# EAGLE design PowerWaechter (EAGLE 9.6.2)
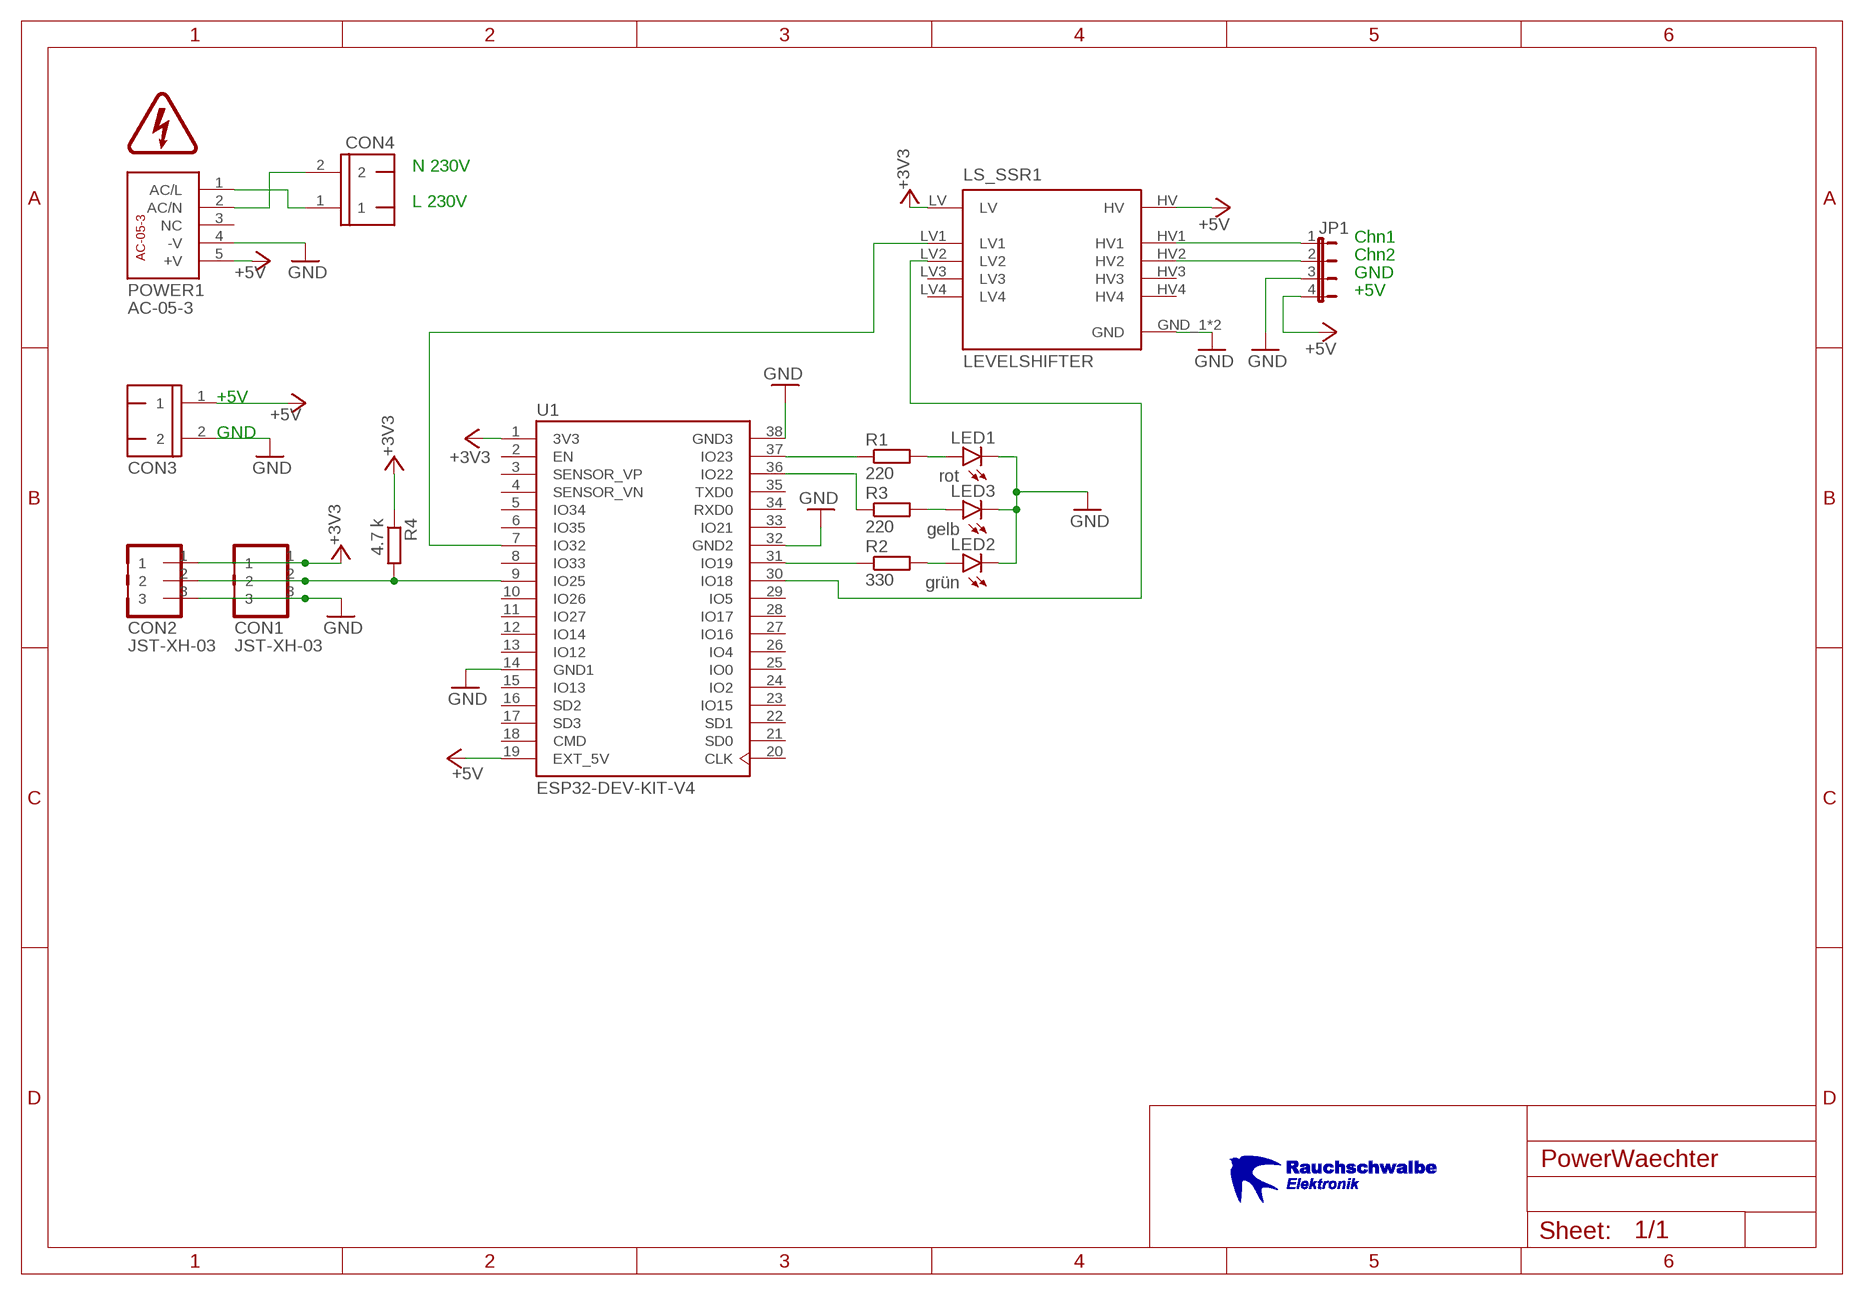
[diagram p0: schematic, sheet 1]

## Parts
CON1  JST-XH-03  [JST-XH-03]
CON2  JST-XH-03  [JST-XH-03]
CON3  WAGO-500-2  [WAGO-500-2]
CON4  WAGO-500-2  [WAGO-500-2]
JP1  JP4E  [JP4]
LED1  rot  LED3MM  [LED3MM]
LED2  grün  LED3MM  [LED3MM]
LED3  gelb  LED3MM  [LED3MM]
LS_SSR1  LEVELSHIFTER  [LEVELSHIFTER]
POWER1  AC-05-3  [AC-05-3]
R1  220  R_10MM0207/10  [0207/10]
R2  330  R_10MM0207/10  [0207/10]
R3  220  R_10MM0207/10  [0207/10]
R4  4.7 k  R_10MM0207/10  [0207/10]
U1  ESP32-DEV-KIT-V4  [ESP32-DEV-KIT-V4]
U$1  WARNLABLE_BLITZ_KLEIN  [WARNLABLE_BLITZ_KLEIN]
U$2  LOGO_RAUCHSCHWALBE_KLEIN  [LOGO_RAUCHSCHWALBE_KLEIN]

## Nets
+3V3 [Versorgung]: CON1.1 CON2.1 LS_SSR1.LV R4.1 U1.1(3V3)
+5V [Versorgung]: CON3.1 JP1.4 LS_SSR1.HV POWER1.5(+V) U1.19(EXT_5V)
GND [Versorgung]: CON1.3 CON2.3 CON3.2 JP1.3 LED1.K(C) LED2.K(C) LED3.K(C) LS_SSR1.GND_1(GND) LS_SSR1.GND_2(GND) POWER1.4(-V) U1.14(GND1) U1.32(GND2) U1.38(GND3)
N$1 [Data]: R1.1 U1.37(IO23)
N$5 [Data]: LED3.A R3.2
N$6 [Data]: R2.1 U1.31(IO19)
N$7 [Data]: LED1.A R1.2
N$8 [Data]: LED2.A R2.2
N$9 [Data]: R3.1 U1.36(IO22)
N$10 [Data]: LS_SSR1.LV1 U1.7(IO32)
N$11 [Data]: CON1.2 CON2.2 R4.2 U1.9(IO25)
N$16 [Data]: LS_SSR1.LV2 U1.30(IO18)
N$18 [Data]: JP1.1 LS_SSR1.HV1
N$19 [Data]: JP1.2 LS_SSR1.HV2
PHASE_L [Netzspannung]: CON4.1 POWER1.1(AC/L)
PHASE_N [Netzspannung]: CON4.2 POWER1.2(AC/N)
Unconnected: LS_SSR1.HV3 LS_SSR1.HV4 LS_SSR1.LV3 LS_SSR1.LV4 POWER1.3(NC) U1.2(EN) U1.3(SENSOR_VP) U1.4(SENSOR_VN) U1.5(IO34) U1.6(IO35) U1.8(IO33) U1.10(IO26) U1.11(IO27) U1.12(IO14) U1.13(IO12) U1.15(IO13) U1.16(SD2) U1.17(SD3) U1.18(CMD) U1.20(CLK) U1.21(SD0) U1.22(SD1) U1.23(IO15) U1.24(IO2) U1.25(IO0) U1.26(IO4) U1.27(IO16) U1.28(IO17) U1.29(IO5) U1.33(IO21) U1.34(RXD0) U1.35(TXD0)

## Notes on the sheet
- N 230V
- L 230V
- Chn1
- Chn2
- GND
- +5V
- +5V
- GND

## Library data of the parts
CON1 CON2 = PowerGuard:JST-XH-03
CON3 CON4 = PowerGuard:WAGO-500-2: WAGO SCREW CLAMP; MPN: 237-102; OC_FARNELL: unknown; OC_NEWARK: 70K9898
JP1 = jumper:JP4E: JUMPER
LED1-LED3 = PowerGuard:LED: LED OSRAM: - CHIPLED LG R971, LG N971, LY N971, LG Q971, LY Q971, LO R971, LY R971 LH N974, LH R974 LS Q976, LO Q976, LY Q976 LO Q996 - Hyper CHIPLED LW Q18S LB Q993, LB Q99A, LB R99A - SideLED LS A670, LO A670, LY A670, LG A670, LP A670 LB A673, LV A673, LT A673, LW A673 LH A674 LY A675 LS A676, LA A676, LO A676, LY A676, LW A676 LS A679, LY A679, LG A679 - Hyper Micro SIDELED® LS Y876, LA Y876, LO Y876, LY Y876 LT Y87S - SmartLED LW L88C, LW L88S LB L89C, LB L89S, LG L890 LS L89K, LO L89K, LY L89K LS L896, LA L896, LO L896, LY L896 - TOPLED LS T670, LO T670, LY T670, LG T670, LP T670 LSG T670, LSP T670, LSY T670, LOP T670, LYG T670 LG T671, LOG T671, LSG T671 LB T673, LV T673, LT T673, LW T673 LH T674 LS T676, LA T676, LO T676, LY T676, LB T676, LH T676, LSB T676, LW T676 LB T67C, LV T67C, LT T67C, LS T67K, LO T67K, LY T67K, LW E67C LS E67B, LA E67B, LO E67B, LY E67B, LB E67C, LV E67C, LT E67C LW T67C LS T679, LY T679, LG T679 LS T770, LO T770, LY T770, LG T770, LP T770 LB T773, LV T773, LT T773, LW T773 LH T774 LS E675, LA E675, LY E675, LS T675 LS T776, LA T776, LO T776, LY T776, LB T776 LHGB T686 LT T68C, LB T68C - Hyper Mini TOPLED® LB M676 - Mini TOPLED Santana® LG M470 LS M47K, LO M47K, LY M47K Source: http://www.osram.convergy.de LUXEON: - LUMILED® LXK2-PW12-R00, LXK2-PW12-S00, LXK2-PW14-U00, LXK2-PW14-V00 LXK2-PM12-R00, LXK2-PM12-S00, LXK2-PM14-U00 LXK2-PE12-Q00, LXK2-PE12-R00, LXK2-PE12-S00, LXK2-PE14-T00, LXK2-PE14-U00 LXK2-PB12-K00, LXK2-PB12-L00, LXK2-PB12-M00, LXK2-PB14-N00, LXK2-PB14-P00, LXK2-PB14-Q00 LXK2-PR12-L00, LXK2-PR12-M00, LXK2-PR14-Q00, LXK2-PR14-R00 LXK2-PD12-Q00, LXK2-PD12-R00, LXK2-PD12-S00 LXK2-PH12-R00, LXK2-PH12-S00 LXK2-PL12-P00, LXK2-PL12-Q00, LXK2-PL12-R00 Source: www.luxeon.com KINGBRIGHT: KA-3528ASYC Source: www.kingbright.com
LS_SSR1 = PowerGuard:LEVELSHIFTER: Logic Level Converter - Bi-Direc Check availability <https://pricing.snapeda.com/parts/BOB-12009/SparkFun/view-part?ref=eda>; AVAILABILITY: In Stock; DESCRIPTION: BSS138 Logic-Level Translator Interface Evaluation Board; MF: SparkFun; MP: BOB-12009; PACKAGE: None; PRICE: None; PURCHASE-URL: https://pricing.snapeda.com/search?q=BOB-12009&ref=eda
POWER1 = PowerGuard:AC-05-3: AC-05-3 AZ-Delivery AC-05-3 Mininetzteil 230V => 5V
R1-R4 = PowerGuard:R_10MM: RESISTOR, European symbol; SPICEPREFIX: R
U1 = PowerGuard:ESP32-DEV-KIT-V4: ESP32-DEVKITC Check availability <https://pricing.snapeda.com/parts/ESP32-DEVKITC/Espressif%20Systems/view-part?ref=eda>; AVAILABILITY: In Stock; CHECK_PRICES: https://www.snapeda.com/parts/ESP32-DEVKITC/Espressif+Systems/view-part/?ref=eda; DESCRIPTION: ESP32-WROOM-32UE series Transceiver; 802.11 b/g/n (Wi-Fi, WiFi, WLAN), Bluetooth ® Smart Ready 4.x Dual Mode Evaluation Board; MF: Espressif Systems; MP: ESP32-DEVKITC; PACKAGE: None; PRICE: None; SNAPEDA_LINK: https://www.snapeda.com/parts/ESP32-DEVKITC/Espressif+Systems/view-part/?ref=snap
U$1 = PowerGuard:WARNLABLE_BLITZ_KLEIN
U$2 = PowerGuard:LOGO_RAUCHSCHWALBE_KLEIN

## Net classes
0 default: width 0.406 mm
1 Versorgung: width 0.762 mm, drill 0.8 mm, clearance 0.508 mm
2 Netzspannung: width 2 mm, drill 1 mm, clearance 3 mm
3 Data: width 0.406 mm, drill 0.6 mm, clearance 0.254 mm

## Board
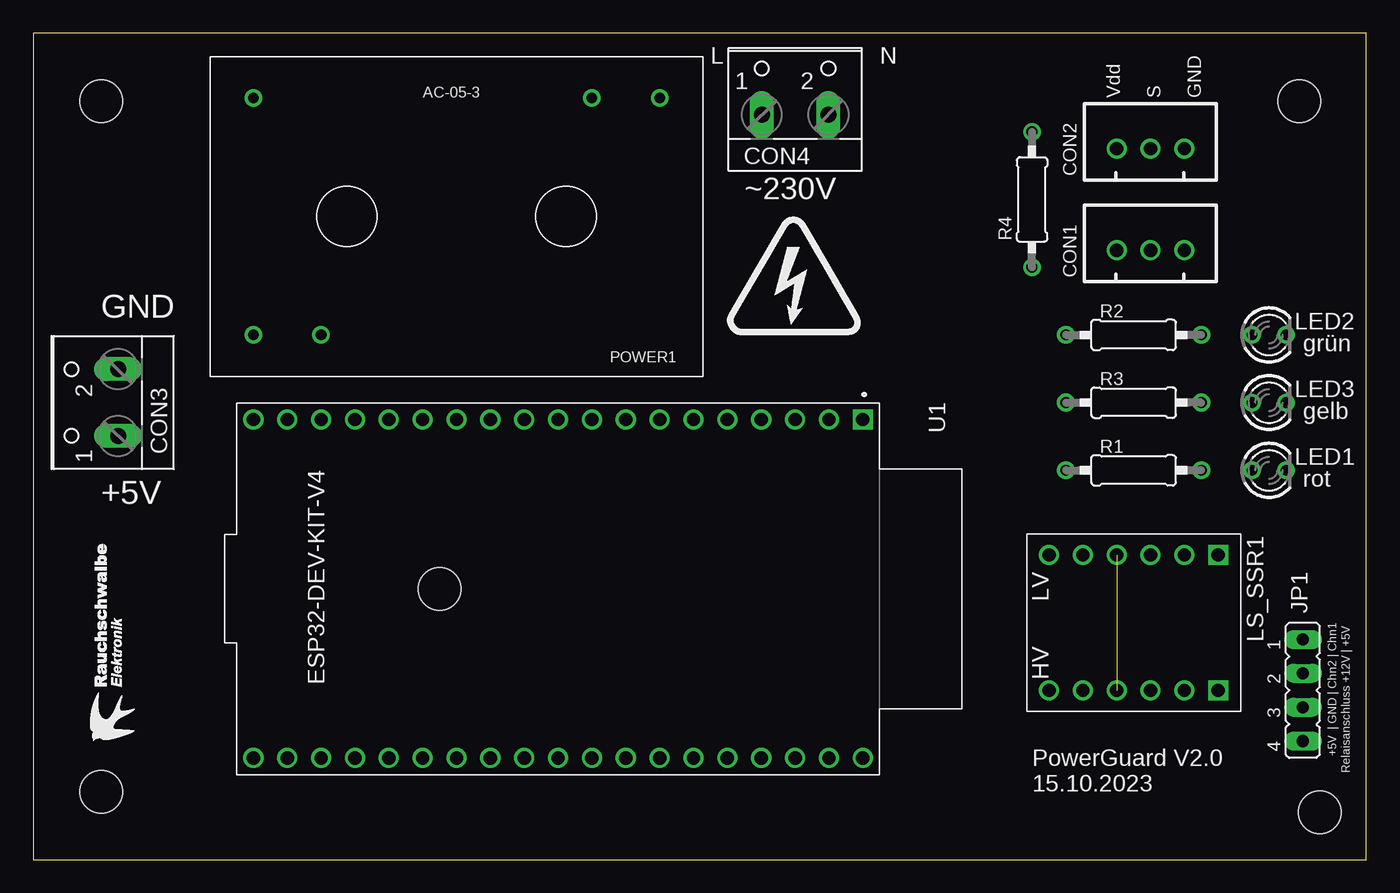
[diagram p1: board, top side]
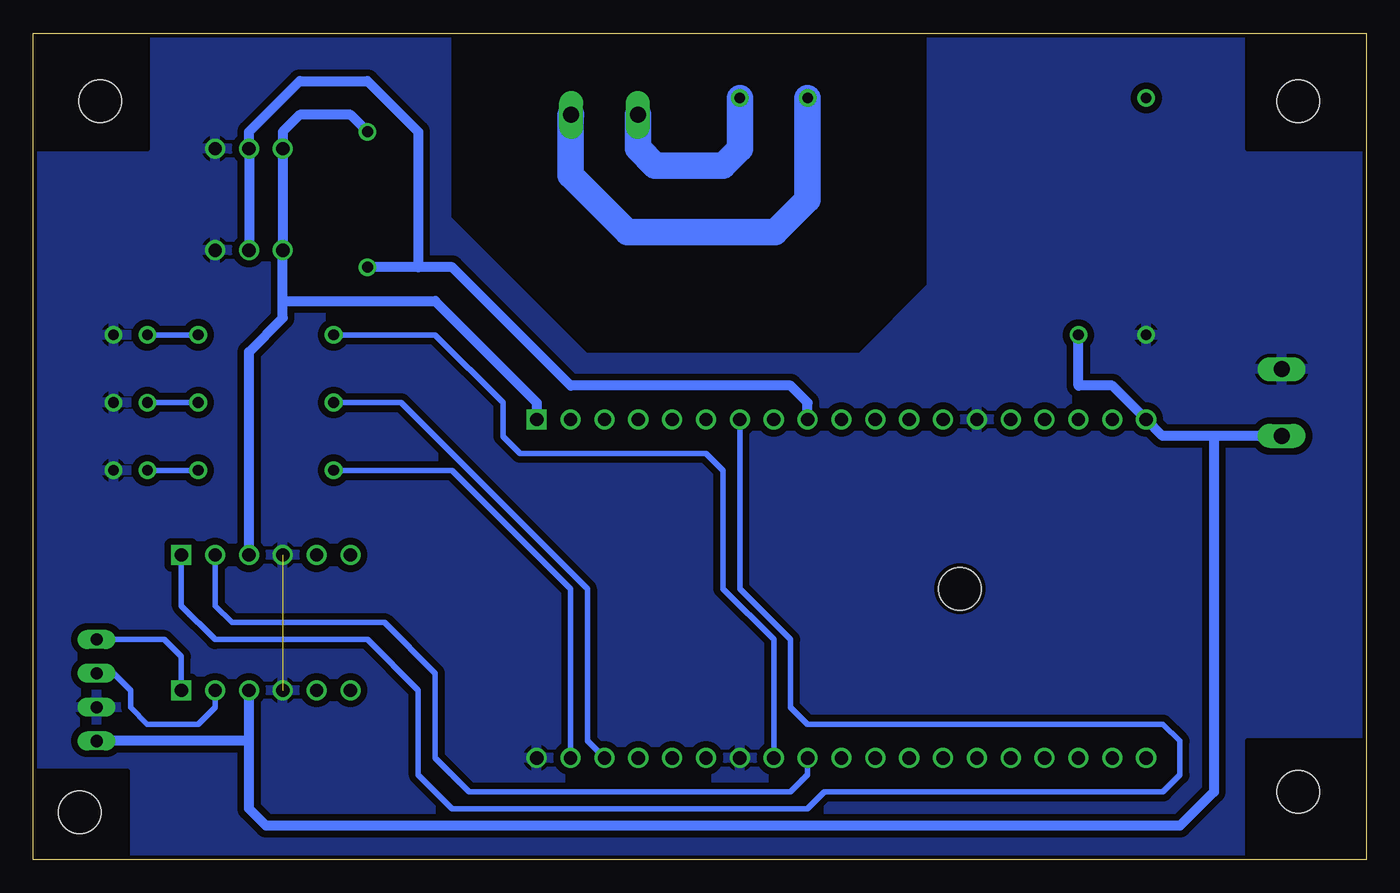
[diagram p2: board, bottom side, seen from below]

Size 100 x 62 mm. Coordinates in mm from the lower left corner, seen from the top.
Outline: 0,0 100,0 100,62 0,62 0,0
Copper layers (1*16): Top 0.035mm / dielectric 1.5mm / Bottom 0.035mm
Design rules "JLCPCB_DRC": minimum track width 5mil, minimum drill 0.3mm, track to track 5mil, track to pad 0.2mm, pad to pad 10mil, via to via 0.5mm, smd to smd 10mil, copper to edge 0.3mm, drill to drill 10mil, minimum pad ring 10mil, minimum via ring 10mil, stop-mask expansion 4mil, vias tented up to drill 0mil, thermal gap 10mil
Holes 3.2 mm at 5.08,56.9 95,56.9 96.52,3.56 5.08,5.08 30.48,20.32
bRestrict: 22 lines

### Footprints (pad centres in the part's own frame; a part is rotated, then mirrored left to right if it is on the bottom)
JST-XH-03 = drill 1: 1 -2.54,0; 2 0,0; 3 2.54,0
WAGO-500-2 = drill 1.2 long: 1 -2.5,-1.27; 2 2.5,-1.27
JP4 = drill 0.914 long: 1 -3.81,0; 2 -1.27,0; 3 1.27,0; 4 3.81,0
LED3MM = drill 0.8: A -1.27,0; K 1.27,0
LEVELSHIFTER = drill 1: GND_1 5.08,-1.27; GND_2 -5.08,-1.27; HV 5.08,1.27; HV2 5.08,3.81; HV3 5.08,-3.81; HV4 5.08,-6.35; LV -5.08,1.27; LV2 -5.08,3.81; LV3 -5.08,-3.81; LV4 -5.08,-6.35 | drill 1 square: HV1 5.08,6.35; LV1 -5.08,6.35
AC-05-3 = drill 0.8: 1 -15.24,-8.89; 2 -10.16,-8.89; 3 15.24,-8.89; 4 15.24,8.89; 5 10.16,8.89
0207/10 = drill 0.813: 1 -5.08,0; 2 5.08,0
ESP32-DEV-KIT-V4 = drill 1 square: 1 -12.7,22.86 | drill 1: 2 -12.7,20.32; 3 -12.7,17.78; 4 -12.7,15.24; 5 -12.7,12.7; 6 -12.7,10.16; 7 -12.7,7.62; 8 -12.7,5.08; 9 -12.7,2.54; 10 -12.7,0; 11 -12.7,-2.54; 12 -12.7,-5.08; 13 -12.7,-7.62; 14 -12.7,-10.16; 15 -12.7,-12.7; 16 -12.7,-15.24; 17 -12.7,-17.78; 18 -12.7,-20.32; 19 -12.7,-22.86; 20 12.7,-22.86; 21 12.7,-20.32; 22 12.7,-17.78; 23 12.7,-15.24; 24 12.7,-12.7; 25 12.7,-10.16; 26 12.7,-7.62; 27 12.7,-5.08; 28 12.7,-2.54; 29 12.7,0; 30 12.7,2.54; 31 12.7,5.08; 32 12.7,7.62; 33 12.7,10.16; 34 12.7,12.7; 35 12.7,15.24; 36 12.7,17.78; 37 12.7,20.32; 38 12.7,22.86

### Placement (x,y rotation side)
CON1  83.82,45.72 0 top
CON2  83.82,53.34 0 top
CON3  5.08,34.29 90 top
CON4  57.15,57.15 0 top
JP1  95.25,12.7 270 top
LED1  92.71,29.21 0 top
LED2  92.71,39.37 0 top
LED3  92.71,34.29 0 top
LS_SSR1  82.55,17.78 270 top
POWER1  31.75,48.26 180 top
R1  82.55,29.21 0 top
R2  82.55,39.37 0 top
R3  82.55,34.29 0 top
R4  74.93,49.53 270 top
U1  39.37,20.32 270 top
U$1  52.07,39.37 0 top
U$2  7.62,8.89 90 top

### Tracks (layer width: path | path; a pad name or v marks a point on that pad's centre or on a via)
+3V3
  Bottom 0.762: R4.1 76.2,55.88 80.01,55.88 81.28,54.61 CON2.1 CON1.1 81.28,41.91 | LS_SSR1.LV 83.82,38.1 81.28,40.64 81.28,41.91 | 81.28,41.91 69.85,41.91 62.23,34.29 U1.1
+5V
  Bottom 0.762: CON3.1 11.43,31.79 | 11.43,31.79 15.28,31.79 U1.19 19.05,35.56 21.59,35.56 POWER1.5 | 11.43,31.79 11.43,5.08 13.97,2.54 82.55,2.54 83.82,3.81 83.82,8.89 | 83.82,8.89 LS_SSR1.HV | 83.82,8.89 JP1.4
GND  (1 unrouted)
  pour Bottom: -2.54,64.77 -2.54,-2.54 102.87,-2.54 102.87,64.77
N$1
  Bottom 0.406: R1.1 68.58,29.21 59.69,20.32 U1.37
N$5
  Bottom 0.406: R3.2 LED3.A
N$6
  Bottom 0.406: U1.31 44.45,16.51 48.26,20.32 48.26,29.21 49.53,30.48 63.5,30.48 64.77,31.75 64.77,34.29 69.85,39.37 R2.1
N$7
  Bottom 0.406: LED1.A R1.2
N$8
  Bottom 0.406: LED2.A R2.2
N$9
  Bottom 0.406: R3.1 72.39,34.29 58.42,20.32 58.42,8.89 U1.36
N$10
  Bottom 0.406: LS_SSR1.LV1 88.9,19.05 86.36,16.51 74.93,16.51 71.12,12.7 71.12,6.35 68.58,3.81 41.91,3.81 40.64,5.08 15.24,5.08 13.97,6.35 13.97,8.89 15.24,10.16 41.91,10.16 43.18,11.43 43.18,16.51 46.99,20.32 U1.7
N$11
  Bottom 0.762: CON1.2 CON2.2 83.82,54.61 80.01,58.42 74.93,58.42 71.12,54.61 71.12,44.45 | U1.9 41.91,34.29 43.18,35.56 59.69,35.56 68.58,44.45 71.12,44.45 | 71.12,44.45 R4.2
N$16
  Bottom 0.406: LS_SSR1.LV2 86.36,19.05 85.09,17.78 73.66,17.78 69.85,13.97 69.85,7.62 67.31,5.08 43.18,5.08 41.91,6.35 U1.30
N$18
  Bottom 0.406: JP1.1 90.17,16.51 88.9,15.24 LS_SSR1.HV1
N$19
  Bottom 0.406: LS_SSR1.HV2 86.36,11.43 87.63,10.16 91.44,10.16 92.71,11.43 92.71,12.7 93.98,13.97 JP1.2
PHASE_L
  Bottom 2: CON4.1 54.65,53.38 53.34,52.07 48.26,52.07 46.99,53.34 POWER1.1
PHASE_N
  Bottom 2: CON4.2 59.69,55.84 59.69,51.35 55.41,47.07 44.37,47.07 41.91,49.53 POWER1.2

### Text on the board
tNames: L | N | AC-05-3 | Vdd / / S / / GND | ~230V | GND | grün | gelb | rot | +5V | +5V | GND | Chn2 | Chn1 | Relaisanschluss +12V | +5V | PowerGuard V2.0 / 15.10.2023